# Altium schematic sheet BatteryMonitorbasic.SchDoc
size A
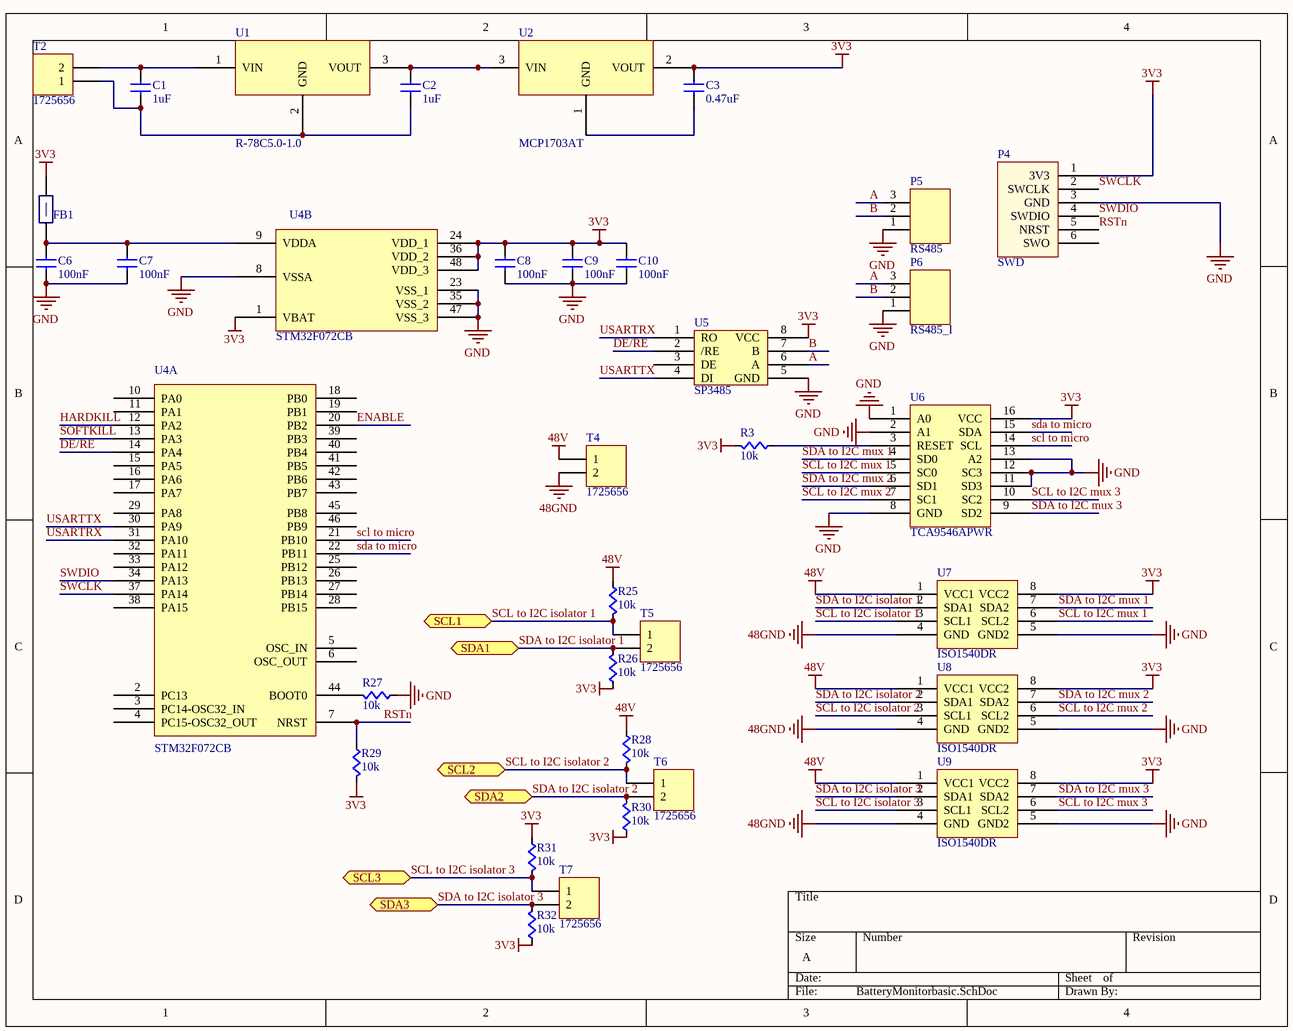
[diagram p0: BatteryMonitorbasic.SchDoc]

## Parts
C1  value 1uF  [CAPC0603]  (hidden comment: Cap)
C2  value 1uF  [CAPC0603]  (hidden comment: Cap)
C3  value 0.47uF  [CAPC0603]  (hidden comment: Cap)
C6  value 100nF  [CAPC0603]  (hidden comment: Cap)
C7  value 100nF  [CAPC0603]  (hidden comment: Cap)
C8  value 100nF  [CAPC0603]  (hidden comment: Cap)
C9  value 100nF  [CAPC0603]  (hidden comment: Cap)
C10  value 100nF  [CAPC0603]  (hidden comment: Cap)
FB1  FBead  [RES0603]  (value not drawn)
P4  SWD  [SWD_STM32]
P5  RS485  [MOLEX-HDR-1X3-SHERLOCK-RA]
P6  RS485_I  [MOLEX-HDR-1X3-SHERLOCK-RA]
R3  value 10k  [RES0603]  (hidden comment: Res)
R25  value 10k  [RES0603]  (hidden comment: Res)
R26  value 10k  [RES0603]  (hidden comment: Res)
R27  value 10k  [RES0603]  (hidden comment: Res)
R28  value 10k  [RES0603]  (hidden comment: Res)
R29  value 10k  [RES0603]  (hidden comment: Res)
R30  value 10k  [RES0603]  (hidden comment: Res)
R31  value 10k  [RES0603]  (hidden comment: Res)
R32  value 10k  [RES0603]  (hidden comment: Res)
T2  1725656  [1725656]
T4  1725656  [1725656]
T5  1725656  [1725656]
T6  1725656  [1725656]
T7  1725656  [1725656]
U1  R-78C5.0-1.0  [R-78C5.0-1.0]
U2  MCP1703AT  [MCP1703AT-xx02EDB]
U4  STM32F072CB  [STM32F072CB]  (parts A,B of 2)
U5  SP3485  [SP3485]
U6  TCA9546APWR  [TCA9546APWR/TSOP65P640X120-16N]
U7  ISO1540DR  [ISO1540DR]
U8  ISO1540DR  [ISO1540DR]
U9  ISO1540DR  [ISO1540DR]

## Ports
SCL1, SCL2, SCL3, SDA1, SDA2, SDA3

## Nets
3V3: C3.1(A) C8.1(A) C9.1(A) C10.1(A) FB1.2(B) P4.1(3V3) R3.1(A) R26.2(B) R29.1(A) R30.2(B) R31.1(A) R32.2(B) U2.2(VOUT) U4.1(VBAT) U4.24(VDD_1) U4.36(VDD_2) U4.48(VDD_3) U5.8(VCC) U6.16(VCC) U7.8(VCC2) U8.8(VCC2) U9.8(VCC2)
48GND: T4.2 U7.4(GND) U8.4(GND) U9.4(GND)
48V: R25.1(A) R28.1(A) T4.1 U7.1(VCC1) U8.1(VCC1) U9.1(VCC1)
GND: C6.2(B) C7.2(B) C8.2(B) C9.2(B) C10.2(B) P4.3(GND) P5.1 P6.1 R27.2(B) U4.8(VSSA) U4.23(VSS_1) U4.35(VSS_2) U4.47(VSS_3) U5.5(GND) U6.1(A0) U6.2(A1) U6.8(GND) U6.11(SD3) U6.12(SC3) U6.13(A2) U7.5(GND2) U8.5(GND2) U9.5(GND2)
A: P5.3 P6.3 U5.6(A)
B: P5.2 P6.2 U5.7(B)
DE/RE: U4.14(PA4) U5.2(/RE)
ENABLE: U4.20(PB2)
HARDKILL: U4.12(PA2)
RSTn: P4.5(NRST) R29.2(B) U4.7(NRST)
SCL to I2C isolator 1: R25.2(B) T5.1 U7.3(SCL1) ; port SCL1
SCL to I2C isolator 2: R28.2(B) T6.1 U8.3(SCL1) ; port SCL2
SCL to I2C isolator 3: R31.2(B) T7.1 U9.3(SCL1) ; port SCL3
SCL to I2C mux 1: U6.5(SC0) U7.6(SCL2)
SCL to I2C mux 2: U6.7(SC1) U8.6(SCL2)
SCL to I2C mux 3: U6.10(SC2) U9.6(SCL2)
scl to micro: U4.21(PB10) U6.14(SCL)
SDA to I2C isolator 1: R26.1(A) T5.2 U7.2(SDA1) ; port SDA1
SDA to I2C isolator 2: R30.1(A) T6.2 U8.2(SDA1) ; port SDA2
SDA to I2C isolator 3: R32.1(A) T7.2 U9.2(SDA1) ; port SDA3
SDA to I2C mux 1: U6.4(SD0) U7.7(SDA2)
SDA to I2C mux 2: U6.6(SD1) U8.7(SDA2)
SDA to I2C mux 3: U6.9(SD2) U9.7(SDA2)
sda to micro: U4.22(PB11) U6.15(SDA)
SOFTKILL: U4.13(PA3)
SWCLK: P4.2(SWCLK) U4.37(PA14)
SWDIO: P4.4(SWDIO) U4.34(PA13)
USARTRX: U4.31(PA10) U5.1(RO)
USARTTX: U4.30(PA9) U5.4(DI)
NetC1_1: C1.1(A) T2.2 U1.1(VIN)
NetC1_2: C1.2(B) C2.2(B) T2.1 U1.2(GND)
NetC2_1: C2.1(A) U1.3(VOUT) U2.3(VIN)
NetC3_2: C3.2(B) U2.1(GND)
NetC6_1: C6.1(A) C7.1(A) FB1.1(A) U4.9(VDDA)
NetR3_2: R3.2(B) U6.3(RESET)
NetR27_1: R27.1(A) U4.44(BOOT0)

Not connected (* = marked no-connect by the designer): P4 6(SWO); U4 2(PC13) 3(PC14-OSC32_IN) 4(PC15-OSC32_OUT) 5(OSC_IN) 6(OSC_OUT) 10(PA0) 11(PA1) 15(PA5) 16(PA6) 17(PA7) 18(PB0) 19(PB1) 25(PB12) 26(PB13) 27(PB14) 28(PB15) 29(PA8) 32(PA11) 33(PA12) 38(PA15) 39(PB3) 40(PB4) 41(PB5) 42(PB6) 43(PB7) 45(PB8) 46(PB9); U5 3(DE)

## Library data of the parts
FB1 = FBead: Ferrite Bead; Supplier 1: Digi-Key; Supplier Part Number 1: 445-2988-1-ND
P4 = SWD_STM32: SWD connector matching the pinout on STM Discovery Boards
P5 P6 = MOLEX-HDR-1x3-SHERLOCK_RA: Header, Molex, 2mm Pitch Sherlock Header, Single Row, Right Angle 3 Circuits, Length 3.3mm; Manufacturer Part Number: 35363-0360; Manufacturer: Molex Connector Corporation; Supplier Part Number 1: WM18932-ND; Supplier 1: Digi-Key
T2 T4-T7 = 1725656: CONN TERM BLOCK 2.54MM 2POS; Supplier 1: Digi-Key; Supplier Part Number 1: 277-1273-ND
U1 = R-78C5.0-1.0: CONV DC/DC 1A 5V OUT SIP VERT; Supplier 1: Digi-Key; Supplier Part Number 1: 945-1395-5-ND
U2 = MCP1703AT: 250 mA, 16V, Low Quiescent Current LDO Regulator; Supplier 1: Digi-Key; Supplier Part Number 1: MCP1703AT-3302E/CBCT-ND
U4 = STM32F072CB: MCU 32BIT 128KB FLASH 48LQFP; Supplier 1: Digi-Key; Supplier Part Number 1: 497-14645-ND
U5 = SP3485: IC TXRX RS485 HALF DUPLEX 8NSOIC; Supplier 1: Digi-Key; Supplier Part Number 1: 1016-1817-1-ND
U6 = TCA9546APWR: IC I2C SW 4CH W/RESET 16TSSOP; Supplier 1: Digi-key; Supplier Part Number 1: 296-40578-1-ND
U7-U9 = ISO1540DR: DGTL ISO 2.5KV 2CH I2C 8SOIC; Supplier 1: Digi-Key; Supplier Part Number 1: ISO1540DR
C1-C3 C6-C10 = Cap: Supplier 1: Digi-Key; Supplier Part Number 1: 1276-1000-1-ND
R3 R25-R32 = Res: Supplier 1: Digi-Key; Supplier Part Number 1: RMCF0603JT10K0CT-ND